# EAGLE design untitled (EAGLE 9.3.2)
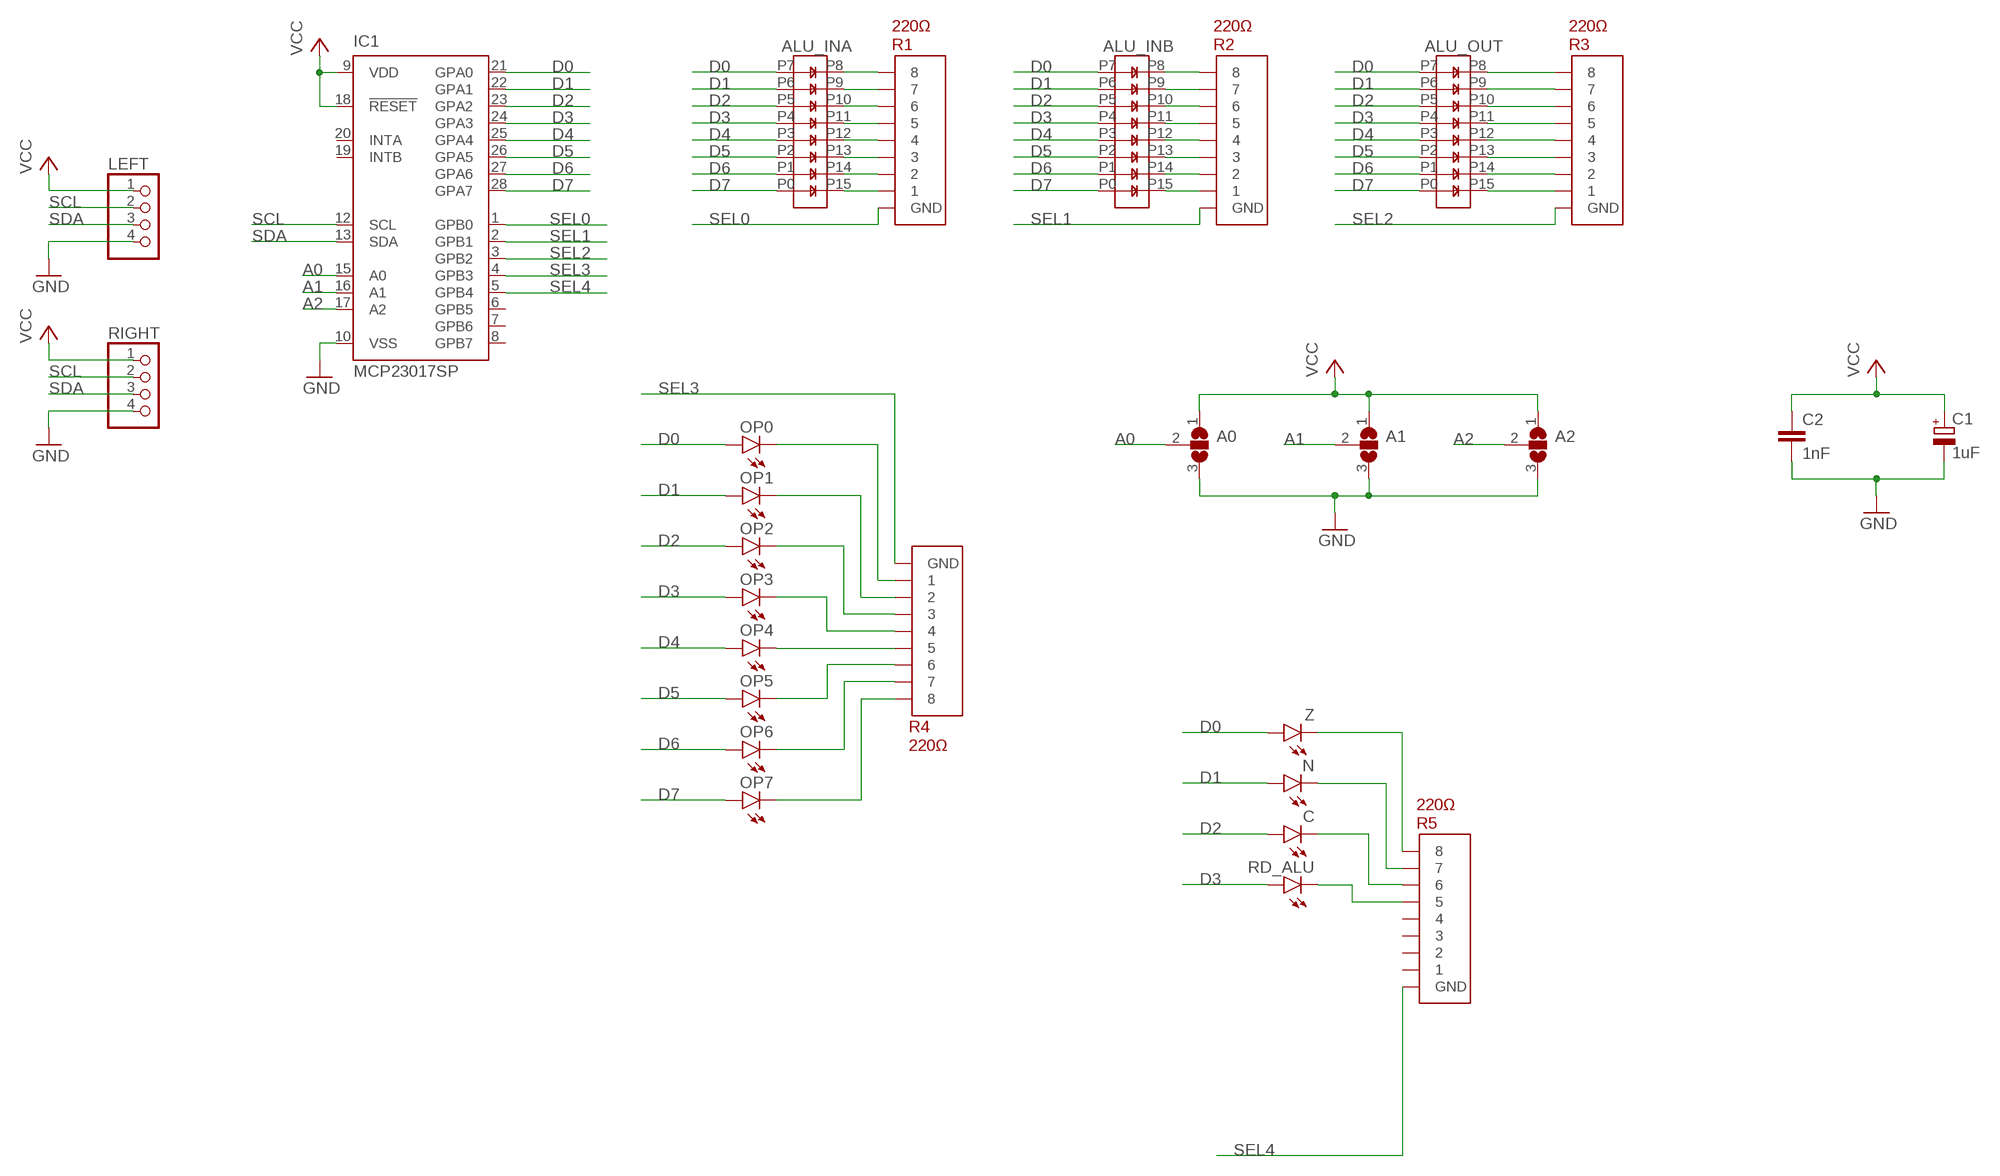
[diagram p0: schematic, sheet 1]

## Parts
A0  SJ2W  [SJ_2]
A1  SJ2W  [SJ_2]
A2  SJ2W  [SJ_2]
ALU_INA  LB8  [LB8]
ALU_INB  LB8  [LB8]
ALU_OUT  LB8  [LB8]
C  LED3MM  [LED3MM]
C1  1uF  CPOL-EUE2.5-6  [E2,5-6]
C2  1nF  C2.5/2  [C2.5-2]
IC1  MCP23017SP  [DIL28-3]
LEFT  PINHD-1X4  [1X04]
N  LED3MM  [LED3MM]
OP0  LED3MM  [LED3MM]
OP1  LED3MM  [LED3MM]
OP2  LED3MM  [LED3MM]
OP3  LED3MM  [LED3MM]
OP4  LED3MM  [LED3MM]
OP5  LED3MM  [LED3MM]
OP6  LED3MM  [LED3MM]
OP7  LED3MM  [LED3MM]
R1  220Ω  R_ARRAY_8PIN  [R_ARRAY_8PIN]
R2  220Ω  R_ARRAY_8PIN  [R_ARRAY_8PIN]
R3  220Ω  R_ARRAY_8PIN  [R_ARRAY_8PIN]
R4  220Ω  R_ARRAY_8PIN  [R_ARRAY_8PIN]
R5  220Ω  R_ARRAY_8PIN  [R_ARRAY_8PIN]
RD_ALU  LED3MM  [LED3MM]
RIGHT  PINHD-1X4  [1X04]
Z  LED3MM  [LED3MM]

## Nets
A0: A0.2 IC1.15(A0)
A1: A1.2 IC1.16(A1)
A2: A2.2 IC1.17(A2)
D0: ALU_INA.P7 ALU_INB.P7 ALU_OUT.P7 IC1.21(GPA0) OP0.A Z.A
D1: ALU_INA.P6 ALU_INB.P6 ALU_OUT.P6 IC1.22(GPA1) N.A OP1.A
D2: ALU_INA.P5 ALU_INB.P5 ALU_OUT.P5 C.A IC1.23(GPA2) OP2.A
D3: ALU_INA.P4 ALU_INB.P4 ALU_OUT.P4 IC1.24(GPA3) OP3.A RD_ALU.A
D4: ALU_INA.P3 ALU_INB.P3 ALU_OUT.P3 IC1.25(GPA4) OP4.A
D5: ALU_INA.P2 ALU_INB.P2 ALU_OUT.P2 IC1.26(GPA5) OP5.A
D6: ALU_INA.P1 ALU_INB.P1 ALU_OUT.P1 IC1.27(GPA6) OP6.A
D7: ALU_INA.P0 ALU_INB.P0 ALU_OUT.P0 IC1.28(GPA7) OP7.A
GND: A0.3 A1.3 A2.3 C1.- C2.2 IC1.10(VSS) LEFT.4 RIGHT.4
N$1: ALU_OUT.P8 R3.8
N$2: ALU_OUT.P9 R3.7
N$3: ALU_OUT.P10 R3.6
N$4: ALU_OUT.P11 R3.5
N$5: ALU_OUT.P12 R3.4
N$6: ALU_OUT.P13 R3.3
N$7: ALU_OUT.P14 R3.2
N$8: ALU_OUT.P15 R3.1
N$9: OP0.K(C) R4.1
N$10: OP1.K(C) R4.2
N$11: OP2.K(C) R4.3
N$12: OP3.K(C) R4.4
N$13: OP4.K(C) R4.5
N$14: OP5.K(C) R4.6
N$15: OP6.K(C) R4.7
N$16: OP7.K(C) R4.8
N$17: ALU_INA.P8 R1.8
N$18: ALU_INA.P9 R1.7
N$19: ALU_INA.P10 R1.6
N$20: ALU_INA.P11 R1.5
N$21: ALU_INA.P12 R1.4
N$22: ALU_INA.P13 R1.3
N$23: ALU_INA.P14 R1.2
N$24: ALU_INA.P15 R1.1
N$25: ALU_INB.P8 R2.8
N$26: ALU_INB.P9 R2.7
N$27: ALU_INB.P10 R2.6
N$28: ALU_INB.P11 R2.5
N$29: ALU_INB.P12 R2.4
N$30: ALU_INB.P13 R2.3
N$31: ALU_INB.P14 R2.2
N$32: ALU_INB.P15 R2.1
N$33: R5.8 Z.K(C)
N$34: N.K(C) R5.7
N$35: C.K(C) R5.6
N$36: R5.5 RD_ALU.K(C)
SCL: IC1.12(SCL) LEFT.2 RIGHT.2
SDA: IC1.13(SDA) LEFT.3 RIGHT.3
SEL0: IC1.1(GPB0) R1.GND
SEL1: IC1.2(GPB1) R2.GND
SEL2: IC1.3(GPB2) R3.GND
SEL3: IC1.4(GPB3) R4.GND
SEL4: IC1.5(GPB4) R5.GND
VCC: A0.1 A1.1 A2.1 C1.+ C2.1 IC1.9(VDD) IC1.18(!RESET) LEFT.1 RIGHT.1
Unconnected: IC1.6(GPB5) IC1.7(GPB6) IC1.8(GPB7) IC1.19(INTB) IC1.20(INTA) R5.1 R5.2 R5.3 R5.4

## Library data of the parts
A0 A1 A2 = jumper:SJ2W: SMD solder JUMPER
ALU_INA ALU_INB ALU_OUT = 8bit_components:LB8
C N OP0 OP1-OP7 RD_ALU Z = led:LED: LED OSRAM: - CHIPLED LG R971, LG N971, LY N971, LG Q971, LY Q971, LO R971, LY R971 LH N974, LH R974 LS Q976, LO Q976, LY Q976 LO Q996 - Hyper CHIPLED LW Q18S LB Q993, LB Q99A, LB R99A - SideLED LS A670, LO A670, LY A670, LG A670, LP A670 LB A673, LV A673, LT A673, LW A673 LH A674 LY A675 LS A676, LA A676, LO A676, LY A676, LW A676 LS A679, LY A679, LG A679 - Hyper Micro SIDELED® LS Y876, LA Y876, LO Y876, LY Y876 LT Y87S - SmartLED LW L88C, LW L88S LB L89C, LB L89S, LG L890 LS L89K, LO L89K, LY L89K LS L896, LA L896, LO L896, LY L896 - TOPLED LS T670, LO T670, LY T670, LG T670, LP T670 LSG T670, LSP T670, LSY T670, LOP T670, LYG T670 LG T671, LOG T671, LSG T671 LB T673, LV T673, LT T673, LW T673 LH T674 LS T676, LA T676, LO T676, LY T676, LB T676, LH T676, LSB T676, LW T676 LB T67C, LV T67C, LT T67C, LS T67K, LO T67K, LY T67K, LW E67C LS E67B, LA E67B, LO E67B, LY E67B, LB E67C, LV E67C, LT E67C LW T67C LS T679, LY T679, LG T679 LS T770, LO T770, LY T770, LG T770, LP T770 LB T773, LV T773, LT T773, LW T773 LH T774 LS E675, LA E675, LY E675, LS T675 LS T776, LA T776, LO T776, LY T776, LB T776 LHGB T686 LT T68C, LB T68C - Hyper Mini TOPLED® LB M676 - Mini TOPLED Santana® LG M470 LS M47K, LO M47K, LY M47K Source: http://www.osram.convergy.de LUXEON: - LUMILED® LXK2-PW12-R00, LXK2-PW12-S00, LXK2-PW14-U00, LXK2-PW14-V00 LXK2-PM12-R00, LXK2-PM12-S00, LXK2-PM14-U00 LXK2-PE12-Q00, LXK2-PE12-R00, LXK2-PE12-S00, LXK2-PE14-T00, LXK2-PE14-U00 LXK2-PB12-K00, LXK2-PB12-L00, LXK2-PB12-M00, LXK2-PB14-N00, LXK2-PB14-P00, LXK2-PB14-Q00 LXK2-PR12-L00, LXK2-PR12-M00, LXK2-PR14-Q00, LXK2-PR14-R00 LXK2-PD12-Q00, LXK2-PD12-R00, LXK2-PD12-S00 LXK2-PH12-R00, LXK2-PH12-S00 LXK2-PL12-P00, LXK2-PL12-Q00, LXK2-PL12-R00 Source: www.luxeon.com KINGBRIGHT: KA-3528ASYC Source: www.kingbright.com
C1 = rcl:CPOL-EU: POLARIZED CAPACITOR, European symbol; SPICEPREFIX: C
C2 = capacitor-wima:C: CAPACITOR naming: grid - package width
IC1 = microchip:MCP23017: http://ww1.microchip.com/downloads/en/DeviceDoc/21952a.pdf Source: http://ww1.microchip.com/downloads/en/DeviceDoc/21952a.pdf; MF: MICROCHIP; MPN: MCP23017-E/SP; OC_FARNELL: 1332088; OC_NEWARK: 31K2959
LEFT RIGHT = pinhead:PINHD-1X4: PIN HEADER
R1-R5 = 8bit_components:R_ARRAY_8PIN

## Board
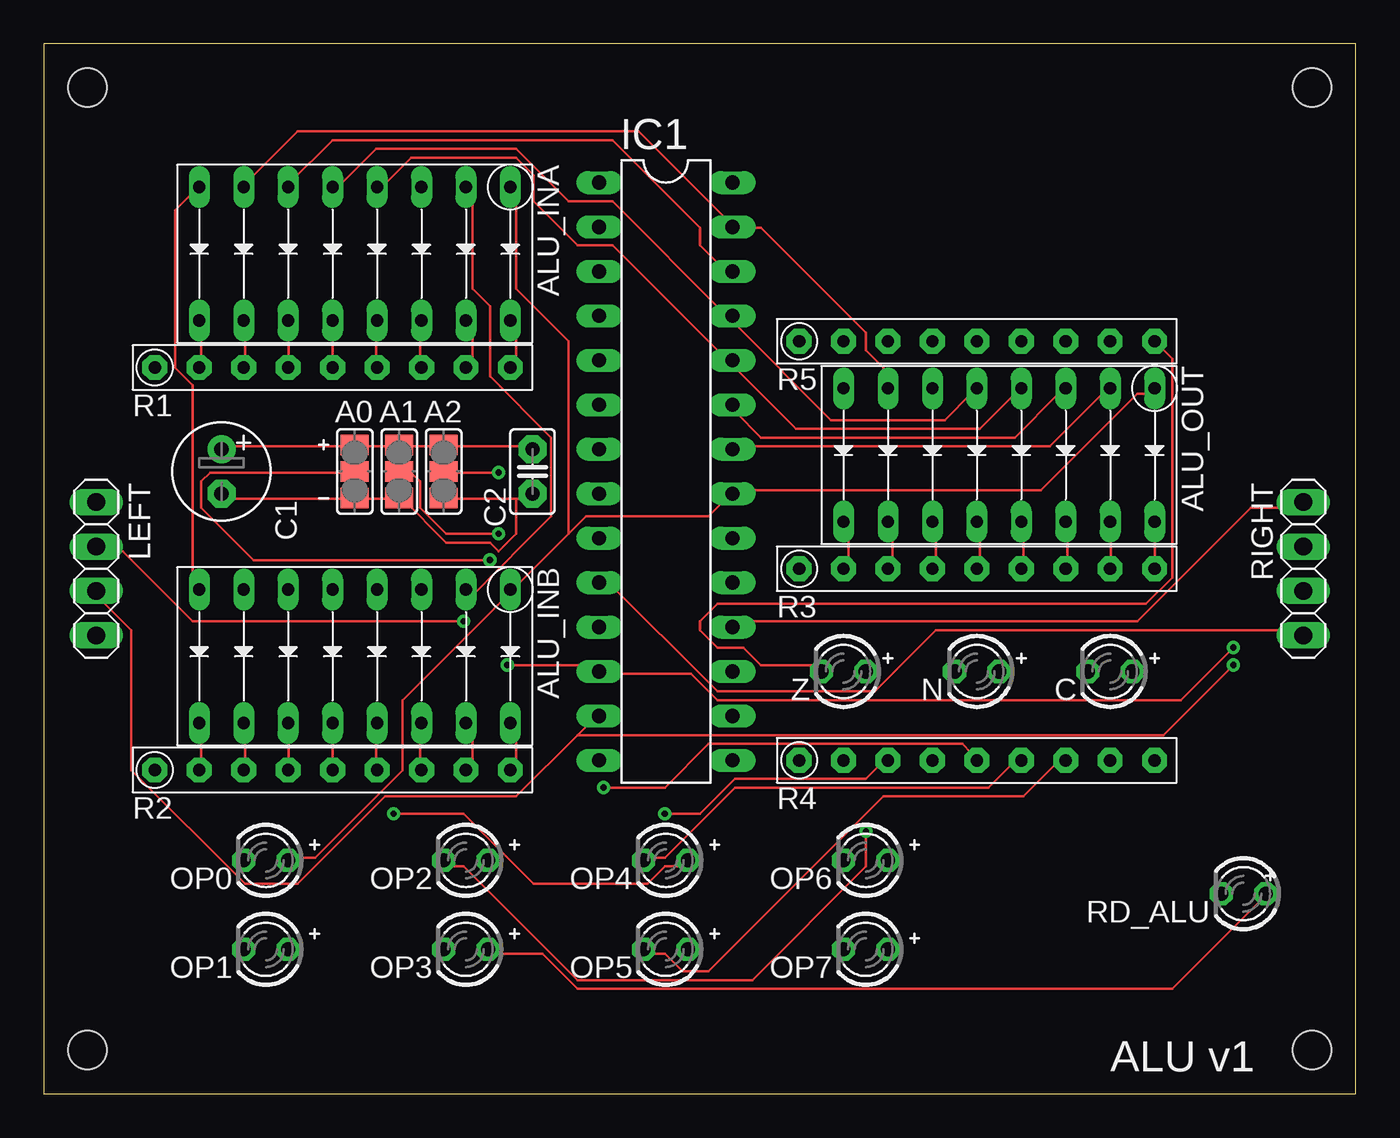
[diagram p1: board, top side]
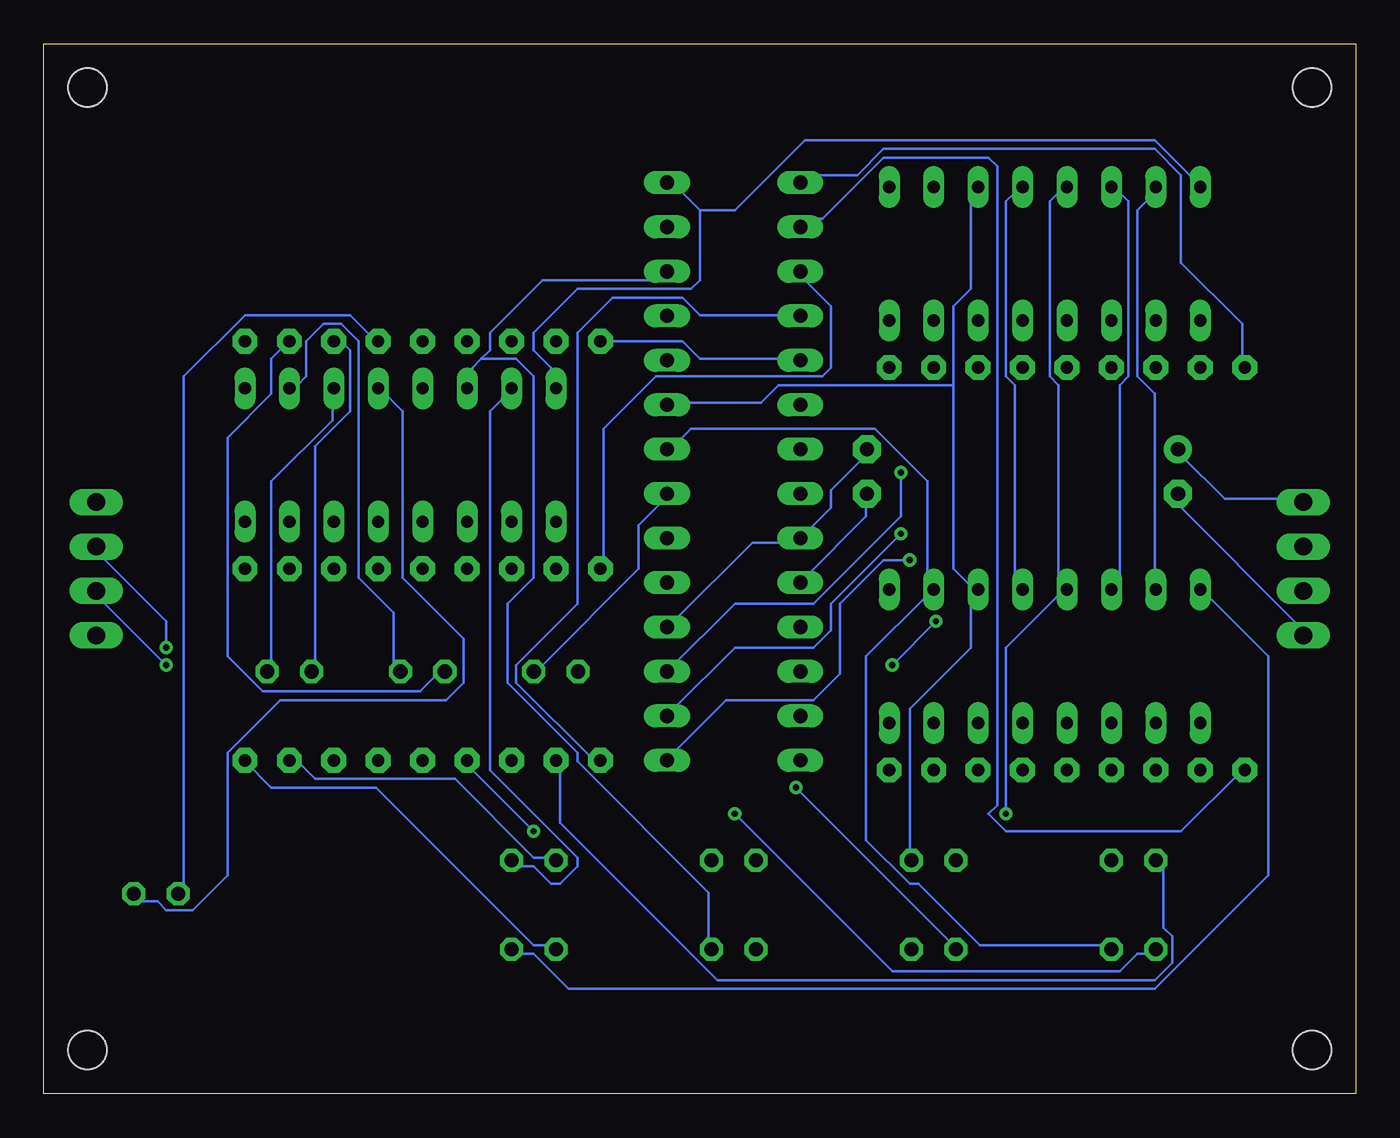
[diagram p2: board, bottom side, seen from below]

Size 75 x 60 mm. Coordinates in mm from the lower left corner, seen from the top.
Outline: 0,0 75,0 75,60 0,60 0,0
Copper layers (1*16): Top 0.035mm / dielectric 1.5mm / Bottom 0.035mm
Design rules "default": minimum track width 6mil, minimum drill 0.35mm, track to track 6mil, track to pad 6mil, pad to pad 6mil, via to via 6mil, smd to smd 6mil, copper to edge 40mil, drill to drill 6mil, minimum pad ring 10mil, minimum via ring 8mil, stop-mask expansion 4mil, vias tented up to drill 0mil, thermal gap 10mil
Holes 2.2 mm at 2.5,57.5 72.5,57.5 2.5,2.5 72.5,2.5
vRestrict: area 15.2,31.8 to 25.4,39.4

### Footprints (pad centres in the part's own frame; a part is rotated, then mirrored left to right if it is on the bottom)
SJ_2 = smd 1.168 x 1.6: 1 -1.524,0; 2 0,0; 3 1.524,0
LB8 = drill 0.7 long: P0 -3.81,-8.89; P1 -3.81,-6.35; P2 -3.81,-3.81; P3 -3.81,-1.27; P4 -3.81,1.27; P5 -3.81,3.81; P6 -3.81,6.35; P7 -3.81,8.89; P8 3.81,8.89; P9 3.81,6.35; P10 3.81,3.81; P11 3.81,1.27; P12 3.81,-1.27; P13 3.81,-3.81; P14 3.81,-6.35; P15 3.81,-8.89
LED3MM = drill 0.813 octagon: A -1.27,0; K 1.27,0
E2,5-6 = drill 0.813 pad 1.6: + -1.27,0 | drill 0.813 pad 1.6 octagon: - 1.27,0
C2.5-2 = drill 0.813 pad 1.6 octagon: 1 -1.27,0; 2 1.27,0
DIL28-3 = drill 0.813 long: 1 -16.51,-3.81; 2 -13.97,-3.81; 3 -11.43,-3.81; 4 -8.89,-3.81; 5 -6.35,-3.81; 6 -3.81,-3.81; 7 -1.27,-3.81; 8 1.27,-3.81; 9 3.81,-3.81; 10 6.35,-3.81; 11 8.89,-3.81; 12 11.43,-3.81; 13 13.97,-3.81; 14 16.51,-3.81; 15 16.51,3.81; 16 13.97,3.81; 17 11.43,3.81; 18 8.89,3.81; 19 6.35,3.81; 20 3.81,3.81; 21 1.27,3.81; 22 -1.27,3.81; 23 -3.81,3.81; 24 -6.35,3.81; 25 -8.89,3.81; 26 -11.43,3.81; 27 -13.97,3.81; 28 -16.51,3.81
1X04 = drill 1.016 long: 1 -3.81,0; 2 -1.27,0; 3 1.27,0; 4 3.81,0
R_ARRAY_8PIN = drill 0.7 pad 1.422 octagon: 1 0,-7.62; 2 0,-5.08; 3 0,-2.54; 4 0,0; 5 0,2.54; 6 0,5.08; 7 0,7.62; 8 0,10.16; GND 0,-10.16

### Placement (x,y rotation side)
A0  17.78,35.56 270 top
A1  20.32,35.56 270 top
A2  22.86,35.56 270 top
ALU_INA  17.78,48 270 top
ALU_INB  17.78,25 270 top
ALU_OUT  54.61,36.5 270 top
C  60.96,24.13 180 top
C1  10.16,35.56 270 top
C2  27.94,35.56 270 top
IC1  35.56,35.56 270 top
LEFT  3,30 270 top
N  53.34,24.13 180 top
OP0  12.7,13.34 180 top
OP1  12.7,8.26 180 top
OP2  24.13,13.34 180 top
OP3  24.13,8.26 180 top
OP4  35.56,13.34 180 top
OP5  35.56,8.26 180 top
OP6  46.99,13.34 180 top
OP7  46.99,8.26 180 top
R1  16.51,41.5 270 top
R2  16.51,18.5 270 top
R3  53.34,30 270 top
R4  53.34,19.05 270 top
R5  53.34,43 270 top
RD_ALU  68.58,11.43 180 top
RIGHT  72,30 270 top
Z  45.72,24.13 180 top

### Tracks (layer width: path | path; a pad name or v marks a point on that pad's centre or on a via)
A0  (via drill 0.35)
  Top 0.152: v25.5,30.5 12,30.5 9,33.5 9,35 9.5,35.5 17.5,35.5 A0.2
  Bottom 0.152: v25.5,30.5 27,30.5 29.5,28 29.5,24 31,22.5 36,22.5 39,19.5 IC1.15
A1  (via drill 0.35)
  Top 0.152: v26,32 23,32 21.5,33.5 21.5,35 21,35.5 20.5,35.5 A1.2
  Bottom 0.152: v26,32 30,28 30,26.5 31,25.5 35.5,25.5 39,22 IC1.16
A2  (via drill 0.35)
  Top 0.152: v26,35.5 23,35.5 A2.2
  Bottom 0.152: v26,35.5 26,33 31,28 35.5,28 IC1.17
D0
  Top 0.152: 30,32 31,33 38,33 39,34 IC1.21 39.5,34.5 57,34.5 62.5,40 63.5,40 ALU_OUT.P7 | 30,32 27,29 ALU_INB.P7 26.5,28.5 20.5,22.5 20.5,18.5 15.5,13.5 14,13.5 OP0.A | 30,32 30,43 27,46 27,51.5 ALU_INA.P7
  Bottom 0.152: Z.A 46.5,24.5 41,30 41,32.5 39.5,34 IC1.21
D1
  Top 0.152: ALU_INA.P6 24.5,51.5 24.5,46 25.5,45 25.5,41 29,37.5 29,33 24.5,28.5 ALU_INB.P6 | ALU_OUT.P6 60.5,40 57.5,37 39.5,37 IC1.22
  Bottom 0.152: IC1.22 39,37 38,38 27.5,38 24.5,35 24.5,29 ALU_INB.P6 24.5,28.5 28,25 28,14.5 25.5,12 25,12 21.5,8.5 14,8.5 OP1.A | N.A 55,24.5 55,27.5 57,29.5 57,43 58,44 59,44 60,43 60,41 60.5,40.5 ALU_OUT.P6
D2
  Top 0.152: ALU_OUT.P5 58,40 55.5,37.5 41,37.5 39.5,39 IC1.23
  Bottom 0.152: ALU_OUT.P5 58.5,40 58.5,38.5 62,35 62,24.5 C.A | OP2.A 25.5,13.5 25.5,22 22,25.5 22,28.5 ALU_INB.P5 22,29 23,30 23,40.5 | 23,40.5 23,45 22,46 22,51.5 ALU_INA.P5 | 23,40.5 33,40.5 34,39.5 39,39.5 IC1.23
D3
  Top 0.152: OP3.A 25.5,8 28.5,8 30.5,6 64.5,6 69.5,11 RD_ALU.A | ALU_OUT.P4 55.5,40 53.5,38 43,38 39.5,41.5 IC1.24 39,42 32.5,48.5 30.5,48.5 28,51 28,52.5 27,53.5 21,53.5 19.5,52 ALU_INA.P4
  Bottom 0.152: ALU_INB.P4 19.5,29 19.5,40.5 20,41 20,51 19.5,51.5 ALU_INA.P4 | RD_ALU.A 69.5,11 68.5,11 68,10.5 66.5,10.5 64.5,12.5 64.5,19.5 61.5,22.5 52,22.5 51,23.5 51,26 54.5,29.5 54.5,39 55.5,40 ALU_OUT.P4
D4  (via drill 0.35)
  Top 0.152: ALU_OUT.P3 53,40 51.5,38.5 45,38.5 39.5,44 IC1.25 39,44.5 32.5,51 30,51 27,54 19,54 17,52 ALU_INA.P3 | v20,16 24,16 28,12 34.5,12 35.5,13 36.5,13 OP4.A
  Bottom 0.152: ALU_INA.P3 17,51.5 17.5,51 17.5,41 17,40.5 17,29 ALU_INB.P3 17,28.5 20,25.5 v20,16
D5
  Top 0.152: ALU_INA.P2 14,52 16.5,54.5 32.5,54.5 37.5,49.5 37.5,48.5 39,47 IC1.26
  Bottom 0.152: ALU_INB.P2 13.5,29 13.5,40.5 13,41 13,51 13.5,51.5 ALU_INA.P2 | 50,42 49.5,42.5 49.5,43.5 46.5,46.5 39.5,46.5 IC1.26 | 50,42 50.5,41.5 50.5,40.5 ALU_OUT.P2 | 50,42 48,42 47,41 47,29.5 48.5,28 48.5,23.5 44.5,19.5 44.5,19 37,11.5 37,8.5 OP5.A
D6
  Top 0.152: ALU_OUT.P1 48,40.5 48,41.5 47,42.5 47,43.5 41,49.5 39.5,49.5 IC1.27 39,50 34,55 14.5,55 11.5,52 ALU_INA.P1
  Bottom 0.152: ALU_INB.P1 11.5,29 11.5,40 12.5,41 12.5,50.5 11.5,51.5 ALU_INA.P1 | OP6.A 48,13 47,13 46,12 45.5,12 44.5,13 44.5,13.5 49.5,18.5 49.5,39 48.5,40 ALU_OUT.P1
D7
  Top 0.152: ALU_INB.P0 8.5,29 8.5,40.5 7.5,41.5 7.5,50.5 8.5,51.5 ALU_INA.P0
  Bottom 0.152: 37.5,50.5 37.5,46.5 38,46 44.5,46 47,43.5 47,42.5 46,41.5 46,40.5 ALU_OUT.P0 | 37.5,50.5 39,52 IC1.28 | OP7.A 48,8 47,8 45,6 11.5,6 5,12.5 5,25 8.5,28.5 ALU_INB.P0 | 37.5,50.5 35.5,50.5 31.5,54.5 11.5,54.5 9,52 ALU_INA.P0
GND
  Top 0.152: C1.- 10.5,34 17.5,34 A0.3 18,34 20,34 A1.3 20.5,34 23,31.5 25.5,31.5 26,31 27,32 27,34 | 27,34 27.5,34 C2.2 | 27,34 23,34 A2.3 | RIGHT.4 72,26.5 51,26.5 47.5,23 38.5,23 32,29.5 IC1.10
  Bottom 0.152: LEFT.4 3,26.5 10.5,34 C1.- | IC1.10 31.5,29.5 28,33 28,34 C2.2
N$1
  Top 0.152: R3.8 ALU_OUT.P8
N$2
  Top 0.152: ALU_OUT.P9 61,32.5 61,30 R3.7
N$3
  Top 0.152: ALU_OUT.P10 58.5,32.5 58.5,30 R3.6
N$4
  Top 0.152: ALU_OUT.P11 56,32.5 56,30 R3.5
N$5
  Top 0.152: ALU_OUT.P12 53.5,32.5 53.5,30 R3.4
N$6
  Top 0.152: ALU_OUT.P13 51,32.5 51,30 R3.3
N$7
  Top 0.152: ALU_OUT.P14 48.5,32.5 48.5,30 R3.2
N$8
  Top 0.152: ALU_OUT.P15 46,32.5 46,30 R3.1
N$9
  Bottom 0.152: OP0.K 11,13 11,9.5 10.5,9 10.5,7.5 11.5,6.5 36.5,6.5 45.5,15.5 45.5,19 R4.1
N$10  (via drill 0.35)
  Top 0.152: v35.5,16 37.5,16 39.5,18 47,18 48,19 R4.2
  Bottom 0.152: v35.5,16 26.5,7 13.5,7 12.5,8 11.5,8 OP1.K
N$11  (via drill 0.35)
  Top 0.152: v47,15 47,13 40.5,6.5 30.5,6.5 24,13 23,13 OP2.K
  Bottom 0.152: v47,15 51,19 R4.3
N$12  (via drill 0.35)
  Top 0.152: v32,17.5 35.5,17.5 38,20 52.5,20 53,19.5 R4.4
  Bottom 0.152: v32,17.5 23,8.5 OP3.K
N$13
  Top 0.152: OP4.K 34.5,13.5 35.5,13.5 39.5,17.5 54,17.5 55.5,19 R4.5
N$14
  Top 0.152: OP5.K 34.5,8 35.5,8 36.5,7 38,7 48,17 56,17 58,19 R4.6
N$15
  Bottom 0.152: OP6.K 46,13.5 47,13.5 51.5,18 59.5,18 60.5,19 R4.7
N$16
  Bottom 0.152: OP7.K 46,8.5 47,8.5 56,17.5 62,17.5 63.5,19 R4.8
N$17
  Top 0.152: ALU_INA.P8 27,44 27,41.5 R1.8
N$18
  Top 0.152: ALU_INA.P9 24.5,44 24.5,41.5 R1.7
N$19
  Top 0.152: ALU_INA.P10 21.5,44 21.5,41.5 R1.6
N$20
  Top 0.152: ALU_INA.P11 19,44 19,41.5 R1.5
N$21
  Top 0.152: ALU_INA.P12 16.5,44 R1.4
N$22
  Top 0.152: ALU_INA.P13 14,44 14,41.5 R1.3
N$23
  Top 0.152: ALU_INA.P14 11.5,44 11.5,41.5 R1.2
N$24
  Top 0.152: ALU_INA.P15 9,44 9,41.5 R1.1
N$25
  Top 0.152: ALU_INB.P8 27,21 27,18.5 R2.8
N$26
  Top 0.152: ALU_INB.P9 24.5,21 24.5,18.5 R2.7
N$27
  Top 0.152: ALU_INB.P10 21.5,21 21.5,18.5 R2.6
N$28
  Top 0.152: ALU_INB.P11 19,21 19,18.5 R2.5
N$29
  Top 0.152: ALU_INB.P12 16.5,21 R2.4
N$30
  Top 0.152: ALU_INB.P13 14,21 14,18.5 R2.3
N$31
  Top 0.152: ALU_INB.P14 11.5,21 11.5,18.5 R2.2
N$32
  Top 0.152: ALU_INB.P15 9,21 9,18.5 R2.1
N$33
  Top 0.152: R5.8 64.5,42 64.5,29.5 63,28 38.5,28 37.5,27 37.5,26.5 38.5,25.5 40,25.5 41,24.5 44,24.5 Z.K
N$34
  Bottom 0.152: N.K 52.5,24 53.5,23 62.5,23 64.5,25 64.5,37.5 62,40 62,42 61,43 R5.7
N$35
  Bottom 0.152: C.K 59.5,24.5 59.5,37 57.5,39 57.5,42.5 58,43 R5.6
N$36
  Bottom 0.152: RD_ALU.K 67,11.5 67,41 63.5,44.5 57.5,44.5 56,43 R5.5
SCL  (via drill 0.35)
  Top 0.152: v68,25.5 65,22.5 38.5,22.5 37,24 32,24 IC1.12 31.5,24.5 v26.5,24.5 | v24,27 8.5,27 4.5,31 3,31 LEFT.2
  Bottom 0.152: v68,25.5 68,27 72,31 RIGHT.2 | v26.5,24.5 v24,27
SDA  (via drill 0.35)
  Top 0.152: 30.5,20.5 27,17 19.5,17 14.5,12 11.5,12 5,18.5 5,26.5 3,28.5 LEFT.3 | 30.5,20.5 31.5,21.5 IC1.13 | v68,24.5 64,20.5 30.5,20.5
  Bottom 0.152: v68,24.5 72,28.5 RIGHT.3
SEL0
  Bottom 0.152: IC1.1 31.5,52.5 28.5,52.5 27,54 11.5,54 10,52.5 10,47.5 6.5,44 6.5,41.5 R1.GND
SEL1
  Bottom 0.152: IC1.2 31.5,50 30.5,50 27,53.5 21,53.5 20.5,53 20.5,16.5 21,16 20,15 10,15 6.5,18.5 R2.GND
SEL2
  Bottom 0.152: IC1.3 31.5,46.5 30,45 30,41.5 30.5,41 40,41 43,38 43,30 R3.GND
SEL3
  Bottom 0.152: IC1.4 32,44.5 37.5,44.5 38.5,45.5 42.5,45.5 44.5,43.5 44.5,28 48,24.5 48,23.5 43.5,19 R4.GND
SEL4
  Bottom 0.152: R5.GND 38.5,43 37.5,42 32,42 IC1.5
VCC
  Top 0.152: C2.1 27.5,37 23,37 A2.1 22.5,37 20.5,37 A1.1 20,37 18,37 A0.1 17.5,37 10.5,37 C1.+ | RIGHT.1 72,33.5 69,33.5 62.5,27 39.5,27 IC1.18
  Bottom 0.152: LEFT.1 3,34 7.5,34 10,36.5 C1.+ | IC1.18 39,27 34.5,31.5 32,31.5 IC1.9 30,33.5 30,34.5 28,36.5 C2.1

### Text on the board
tPlace: ALU v1
ALU_A: ALU | FLAGS | Z | N | C | ALU OP | A+B | A+1 | !A | OR | A-B | A-1 | AND | XOR